# Altium schematic sheet MB_commutation.SchDoc
size 594 x 420 mm; SheetNumber: 6; SheetTotal: 8
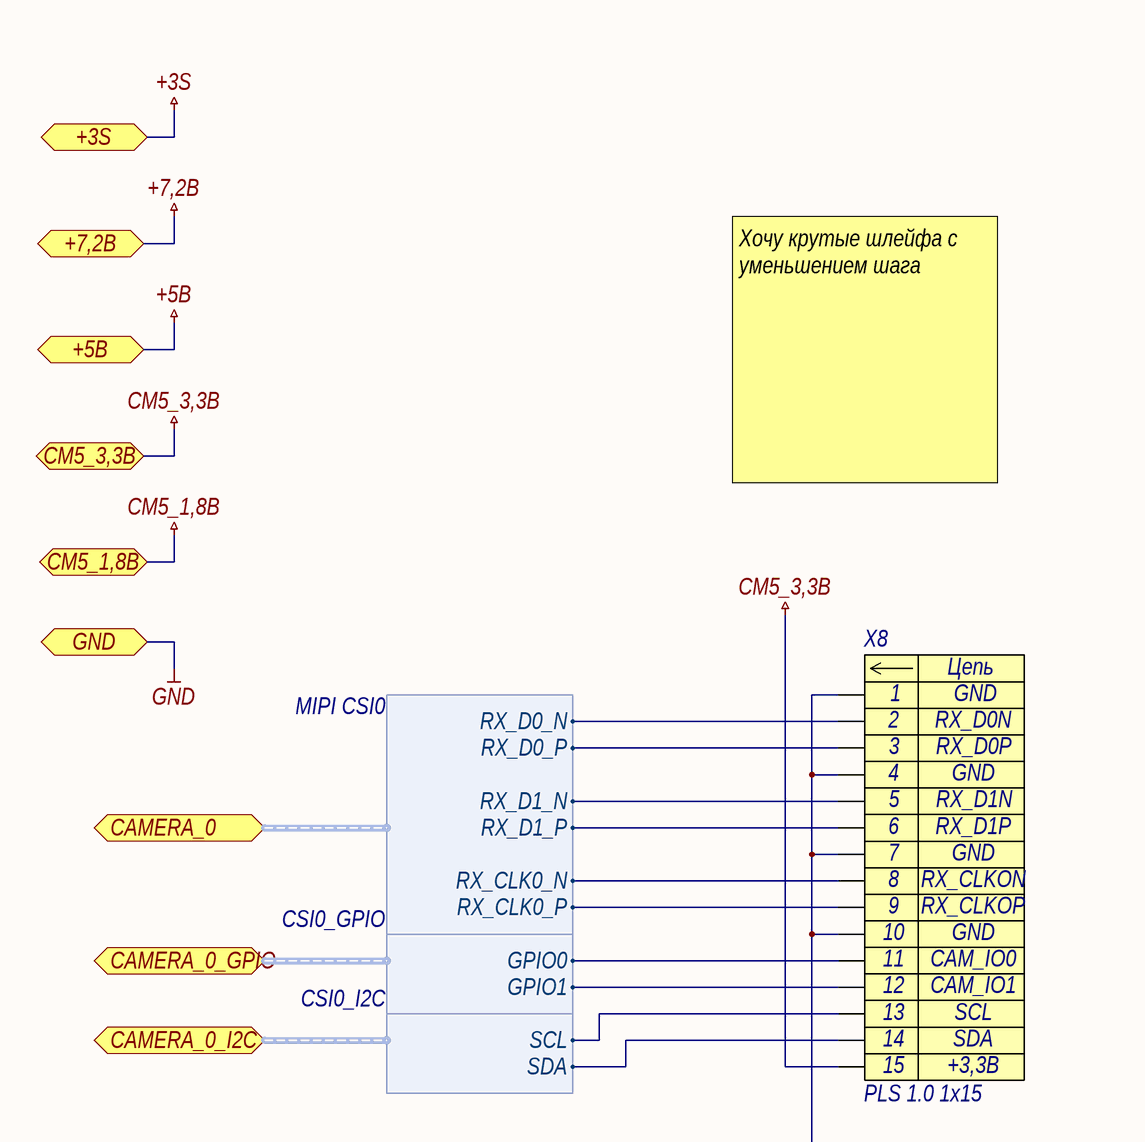
[diagram p0: MB_commutation.SchDoc, top left]
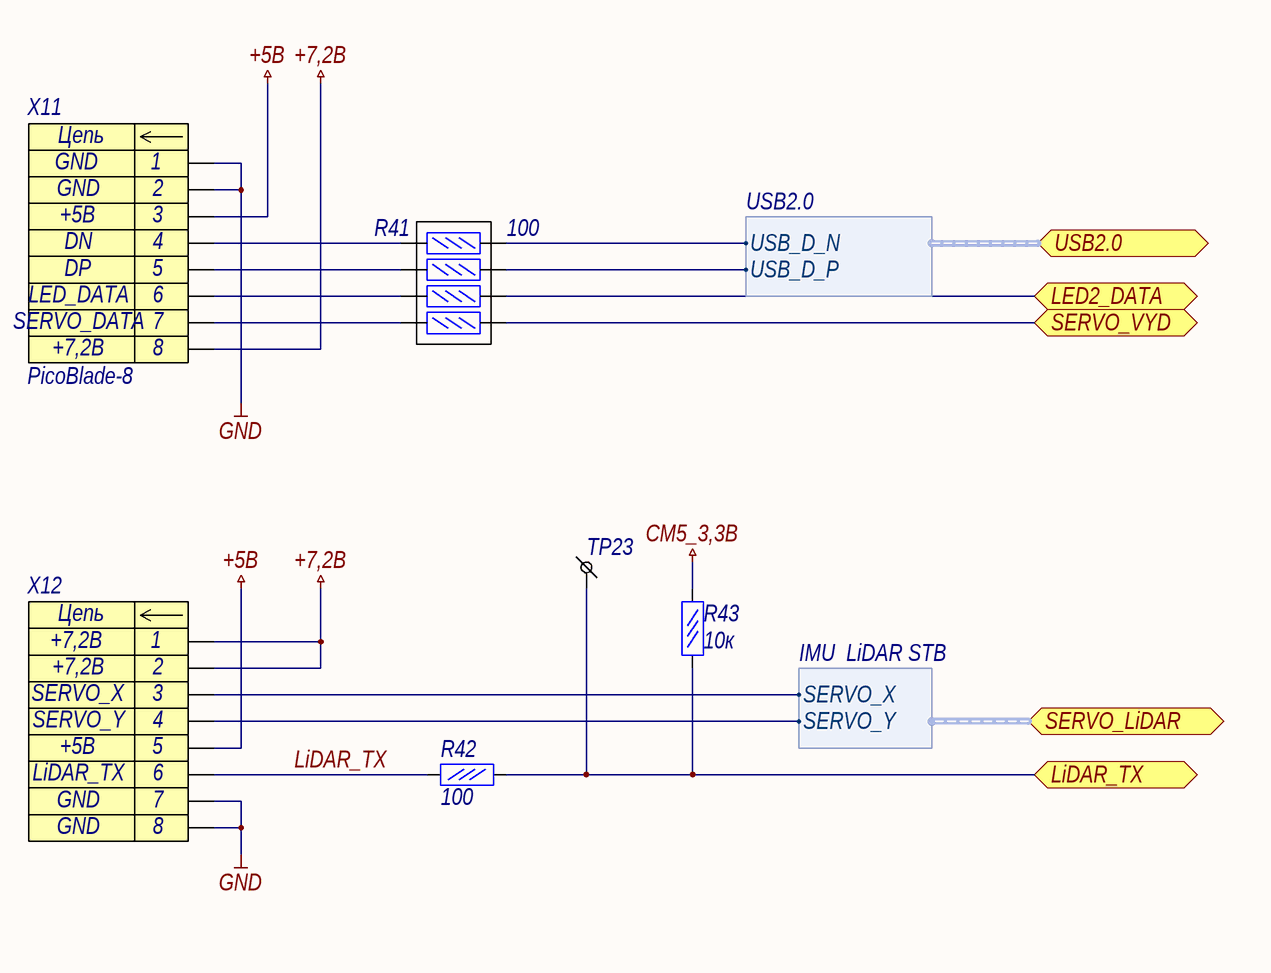
[diagram p1: MB_commutation.SchDoc, top right]
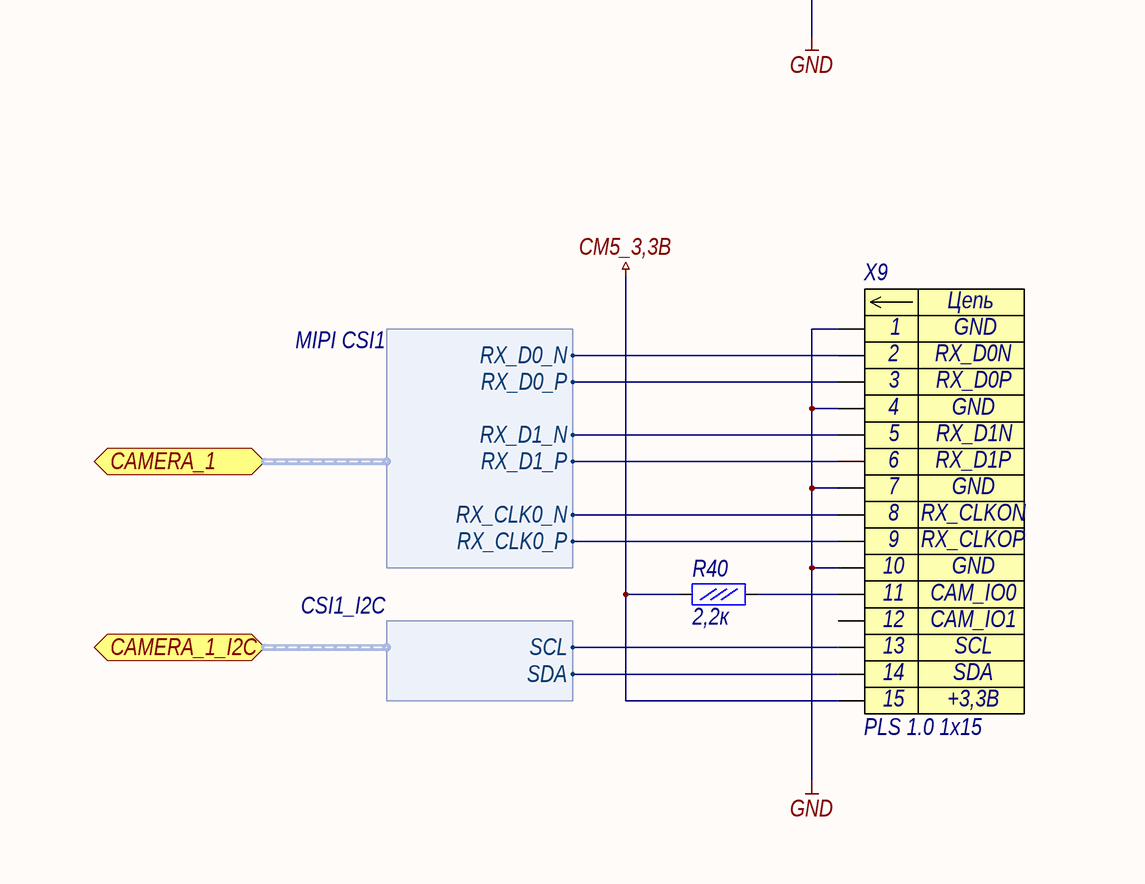
[diagram p2: MB_commutation.SchDoc, bottom left]
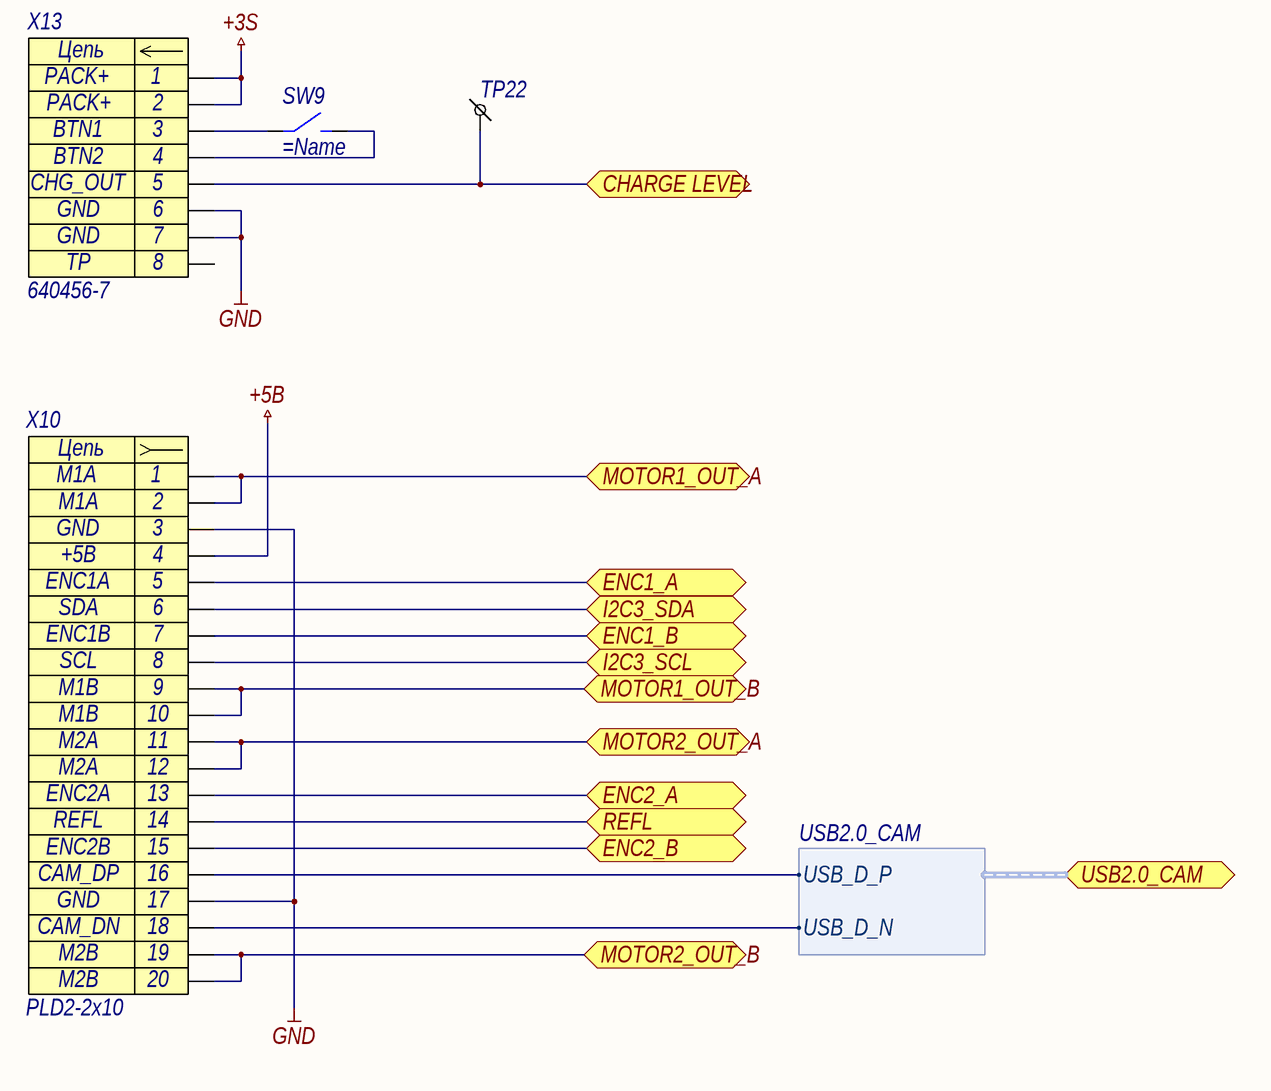
[diagram p3: MB_commutation.SchDoc, bottom right]

## Parts
R40  2,2к  [R0402]
R41  100  [R0402x4]
R42  100  [R0402]
R43  10к  [R0402]
SW9  (no value)  [KTD0621]
TP22  TestPoint  [0.5 x 0,9_round]  (value not drawn)
TP23  TestPoint  [0.5 x 0,9_round]  (value not drawn)
X8  PLS 1.0 1x15  [PLS_1x15 1.0 - without contour]
X9  PLS 1.0 1x15  [PLS_1x15 1.0 - without contour]
X10  PLD2-2x10  [PLS 2.00 10x2]
X11  PicoBlade-8  [PicoBlade-8 fallen]
X12  (no value)  [PLS 4 x 2]
X13  640456-7  [JST-640456-7]

## Ports
+3S (bidir), +5В (bidir), +7,2В (bidir), CAMERA_0 (bidir, harness MIPI CSI0), CAMERA_0_GPIO (bidir, harness CSI0_GPIO), CAMERA_0_I2C (bidir, harness CSI0_I2C), CAMERA_1 (bidir, harness MIPI CSI1), CAMERA_1_I2C (bidir, harness CSI1_I2C), CHARGE LEVEL (bidir), CM5_1,8В (bidir), CM5_3,3В (bidir), ENC1_A (bidir), ENC1_B (bidir), ENC2_A (bidir), ENC2_B (bidir), GND (bidir), I2C3_SCL (bidir), I2C3_SDA (bidir), LED2_DATA (bidir), LiDAR_TX (bidir), MOTOR1_OUT_A (bidir), MOTOR1_OUT_B (bidir), MOTOR2_OUT_A (bidir), MOTOR2_OUT_B (bidir), REFL (bidir), SERVO_LiDAR (bidir, harness IMU  LiDAR STB), SERVO_VYD (bidir), USB2.0 (bidir, harness USB2.0), USB2.0_CAM (bidir, harness USB2.0_CAM)

## Harnesses
IMU  LiDAR STB: SERVO_Y, SERVO_X
CSI0_GPIO: GPIO0, GPIO1
CSI0_I2C: SCL, SDA
CSI1_I2C: SCL, SDA
USB2.0_CAM: USB_D_N, USB_D_P
MIPI CSI1: RX_D0_N, RX_D0_P, RX_D1_N, RX_D1_P, RX_CLK0_N, RX_CLK0_P
MIPI CSI0: RX_D0_N, RX_D0_P, RX_D1_N, RX_D1_P, RX_CLK0_N, RX_CLK0_P
USB2.0: USB_D_N, USB_D_P

## Nets
+3S: X13.1 X13.2 ; port +3S
+5В: X10.4 X11.3 X12.5 ; port +5В
+7,2В: X11.8 X12.1 X12.2 ; port +7,2В
CM5_1,8В: port CM5_1,8В
CM5_3,3В: R40.2 R43.2 X8.15 X9.15 ; port CM5_3,3В
GND: X8.1 X8.4 X8.7 X8.10 X9.1 X9.4 X9.7 X9.10 X10.3 X10.17 X11.1 X11.2 X12.7 X12.8 X13.6 X13.7 ; port GND
CHARGE LEVEL: TP22.1 X13.5 ; port CHARGE LEVEL
ENC1_A: X10.5 ; port ENC1_A
ENC1_B: X10.7 ; port ENC1_B
ENC2_A: X10.13 ; port ENC2_A
ENC2_B: X10.15 ; port ENC2_B
I2C3_SCL: X10.8 ; port I2C3_SCL
I2C3_SDA: X10.6 ; port I2C3_SDA
LED2_DATA: R41.6 ; port LED2_DATA
LiDAR_TX: R42.1 R43.1 TP23.1 ; port LiDAR_TX
LiDAR_TX: R42.2 X12.6  [a separate net that carries the same name]
MOTOR1_OUT_A: X10.1 X10.2 ; port MOTOR1_OUT_A
MOTOR1_OUT_B: X10.9 X10.10 ; port MOTOR1_OUT_B
MOTOR2_OUT_A: X10.11 X10.12 ; port MOTOR2_OUT_A
MOTOR2_OUT_B: X10.19 X10.20 ; port MOTOR2_OUT_B
REFL: X10.14 ; port REFL
SERVO_VYD: R41.8 ; port SERVO_VYD
NetR40_1: R40.1 X9.11
NetR41_1: R41.1 X11.4
NetR41_2: R41.2 ; port USB2.0.USB_D_N
NetR41_3: R41.3 X11.5
NetR41_4: R41.4 ; port USB2.0.USB_D_P
NetR41_5: R41.5 X11.6
NetR41_7: R41.7 X11.7
NetSW9_1: SW9.1 X13.3
NetSW9_2: SW9.2 X13.4
NetX8_2: X8.2 ; port CAMERA_0.RX_D0_N
NetX8_3: X8.3 ; port CAMERA_0.RX_D0_P
NetX8_5: X8.5 ; port CAMERA_0.RX_D1_N
NetX8_6: X8.6 ; port CAMERA_0.RX_D1_P
NetX8_8: X8.8 ; port CAMERA_0.RX_CLK0_N
NetX8_9: X8.9 ; port CAMERA_0.RX_CLK0_P
NetX8_11: X8.11 ; port CAMERA_0_GPIO.GPIO0
NetX8_12: X8.12 ; port CAMERA_0_GPIO.GPIO1
NetX8_13: X8.13 ; port CAMERA_0_I2C.SCL
NetX8_14: X8.14 ; port CAMERA_0_I2C.SDA
NetX9_2: X9.2 ; port CAMERA_1.RX_D0_N
NetX9_3: X9.3 ; port CAMERA_1.RX_D0_P
NetX9_5: X9.5 ; port CAMERA_1.RX_D1_N
NetX9_6: X9.6 ; port CAMERA_1.RX_D1_P
NetX9_8: X9.8 ; port CAMERA_1.RX_CLK0_N
NetX9_9: X9.9 ; port CAMERA_1.RX_CLK0_P
NetX9_13: X9.13 ; port CAMERA_1_I2C.SCL
NetX9_14: X9.14 ; port CAMERA_1_I2C.SDA
NetX10_16: X10.16 ; port USB2.0_CAM.USB_D_P
NetX10_18: X10.18 ; port USB2.0_CAM.USB_D_N
NetX12_3: X12.3 ; port SERVO_LiDAR.SERVO_X
NetX12_4: X12.4 ; port SERVO_LiDAR.SERVO_Y

Not connected (* = marked no-connect by the designer): X9 12; X13 0

## Notes on the sheet
- Хочу крутые шлейфа с уменьшением шага
- Подп. и дата
- Инв. № дубл.
- Взам. инв. №
- Инв. № подл.
- Лист
- Изм.
- № докум.
- Подп.
- Дата
- Копировал
- Формат
- А2
- (in symbol Header_7_fth) Цепь; 8
- (in symbol Header_8) Цепь
- (in symbol Header_15) Цепь
- (in symbol PLS 10 x 2) Цепь

## Library data of the parts
R40 R42 R43 = Резистор 0.05Вт: Резистор 0,05Вт
  R40: Value: 2,2к
  R42: Value: 100
  R43: Value: 10к
R41 = Резисторная сборка 0.05 x 4: Value: 100
SW9 = button
X8 X9 = Header_15: Разъем - 15 конт. папа; Contact_1: GND; Contact_2: RX_D0N; Contact_3: RX_D0P; Contact_5: RX_D1N; Contact_6: RX_D1P; Contact_8: RX_CLKON; Contact_9: RX_CLKOP; Contact_11: CAM_IO0; Contact_12: CAM_IO1; Contact_13: SCL; Contact_14: SDA; Contact_15: +3,3В; Contact_4: GND; Contact_7: GND; Contact_10: GND; Name: PLS 1.0 1x15
X10 = PLS 10 x 2: Contact_1: M1A; Contact_3: GND; Contact_4: +5В; Contact_5: ENC1A; Contact_6: SDA; Contact_7: ENC1B; Contact_8: SCL; Contact_9: M1B; Contact_11: M2A; Contact_13: ENC2A; Contact_14: REFL; Contact_15: ENC2B; Contact_16: CAM_DP; Contact_18: CAM_DN; Contact_19: M2B; Contact_2: M1A; Contact_10: M1B; Contact_12: M2A; Contact_17: GND; Contact_20: M2B; Name: PLD2-2x10
X11 = Header_8: Разъем - 8 конт. мама; Contact_1: GND; Contact_3: +5В; Contact_4: DN; Contact_5: DP; Contact_6: LED_DATA; Contact_7: SERVO_DATA; Contact_8: +7,2В; Contact_2: GND; Name: PicoBlade-8
X12 = Header_8: Разъем - 8 конт. мама; Contact_1: +7,2В; Contact_3: SERVO_X; Contact_4: SERVO_Y; Contact_5: +5В; Contact_6: LiDAR_TX; Contact_7: GND; Contact_2: +7,2В; Contact_8: GND
X13 = Header_7_fth: Разъем - 7 конт. папа; Contact_1: PACK+; Contact_3: BTN1; Contact_4: BTN2; Contact_5: CHG_OUT; Contact_6: GND; Contact_8: TP; Contact_2: PACK+; Contact_7: GND; Name: 640456-7